# EAGLE design versao1 (EAGLE 9.6.2)
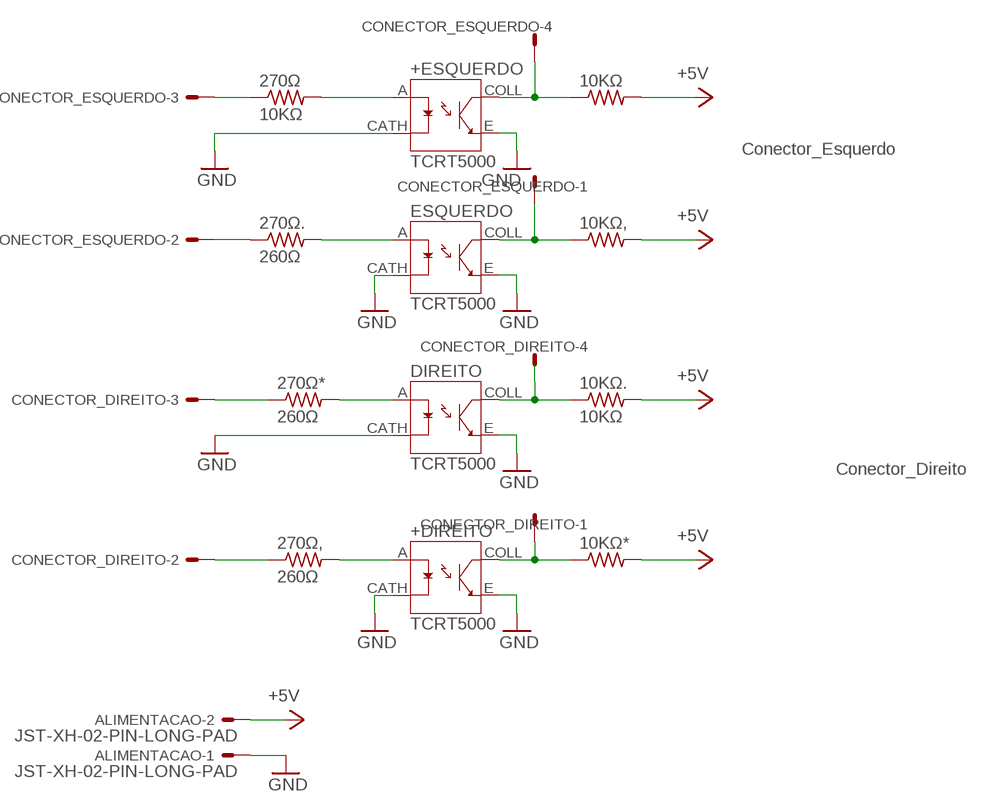
[diagram p0: schematic, sheet 1]

## Parts
10KΩ  R-US_0204/7  [0204/7]
10KΩ*  R-US_0204/7  [0204/7]
10KΩ,  R-US_0204/7  [0204/7]
10KΩ.  10KΩ  R-US_0204/7  [0204/7]
270Ω  10KΩ  R-US_0204/7  [0204/7]
270Ω*  260Ω  R-US_0204/7  [0204/7]
270Ω,  260Ω  R-US_0204/7  [0204/7]
270Ω.  260Ω  R-US_0204/7  [0204/7]
+DIREITO  TCRT5000  [OPTO_TCRT5000]
+ESQUERDO  TCRT5000  [OPTO_TCRT5000]
ALIMENTACAO  JST-XH-02-PIN-LONG-PAD  [JST-XH-02-PACKAGE-LONG-PAD]
CONECTOR_DIREITO  Conector_Direito  JST-XH-04-PIN-LONG-PAD  [JST-XH-04-PACKAGE-LONG-PAD]
CONECTOR_ESQUERDO  Conector_Esquerdo  JST-XH-04-PIN-LONG-PAD  [JST-XH-04-PACKAGE-LONG-PAD]
DIREITO  TCRT5000  [OPTO_TCRT5000]
ESQUERDO  TCRT5000  [OPTO_TCRT5000]

## Nets
+5V: 10KΩ*.2 10KΩ,.2 10KΩ.2 10KΩ..2 ALIMENTACAO.2
ANALOG_+DI: 10KΩ*.1 +DIREITO.COLL CONECTOR_DIREITO.1
ANALOG_+ESQ.: 10KΩ.1 +ESQUERDO.COLL CONECTOR_ESQUERDO.4
ANALOG_DI: 10KΩ..1 CONECTOR_DIREITO.4 DIREITO.COLL
ANALOG_ESQ: 10KΩ,.1 CONECTOR_ESQUERDO.1 ESQUERDO.COLL
DIGITAL+ESQ.: 270Ω.1 CONECTOR_ESQUERDO.3
DIGITAL_+DI: 270Ω,.1 CONECTOR_DIREITO.2
DIGITAL_DI: 270Ω*.1 CONECTOR_DIREITO.3
DIGITAL_ESQ.: 270Ω..1 CONECTOR_ESQUERDO.2
GND: +DIREITO.CATH +DIREITO.E +ESQUERDO.CATH +ESQUERDO.E ALIMENTACAO.1 DIREITO.CATH DIREITO.E ESQUERDO.CATH ESQUERDO.E
N$1: 270Ω.2 +ESQUERDO.A
N$2: 270Ω..2 ESQUERDO.A
N$3: 270Ω*.2 DIREITO.A
N$4: 270Ω,.2 +DIREITO.A

## Library data of the parts
10KΩ 10KΩ* 10KΩ, 10KΩ. 270Ω 270Ω* 270Ω, 270Ω. = rcl_robotica:R-US_: RESISTOR, American symbol; SPICEPREFIX: R
+DIREITO +ESQUERDO DIREITO ESQUERDO = TCRT5000:TCRT5000: 950 nm 60 mA Through Hole Reflective Optical Sensor with Transistor Output Check availability <https://pricing.snapeda.com/parts/TCRT5000/Vishay/view-part?ref=eda>; AVAILABILITY: In Stock; DESCRIPTION: Reflective Optical Sensor 0.591 (15mm) PCB Mount; MF: Vishay; MP: TCRT5000; PACKAGE: TCRT5000 Vishay; PRICE: None; PURCHASE-URL: https://pricing.snapeda.com/search?q=TCRT5000&ref=eda
ALIMENTACAO = Rembrandt Electronics - JST XH Connectors v1-0:JST-XH-02-PIN: JST XH Connector 2 Pin Wire to board connector. Pitch: 2,54 mm, (0.100") Number of pins: 2 Created by Rembrandt Electronics www.rembrandtelectronics.com
CONECTOR_DIREITO CONECTOR_ESQUERDO = Rembrandt Electronics - JST XH Connectors v1-0:JST-XH-04-PIN: JST XH Connector 2 Pin Wire to board connector. Pitch: 2,54 mm, (0.100") Number of pins: 4 Created by Rembrandt Electronics www.rembrandtelectronics.com

## Board
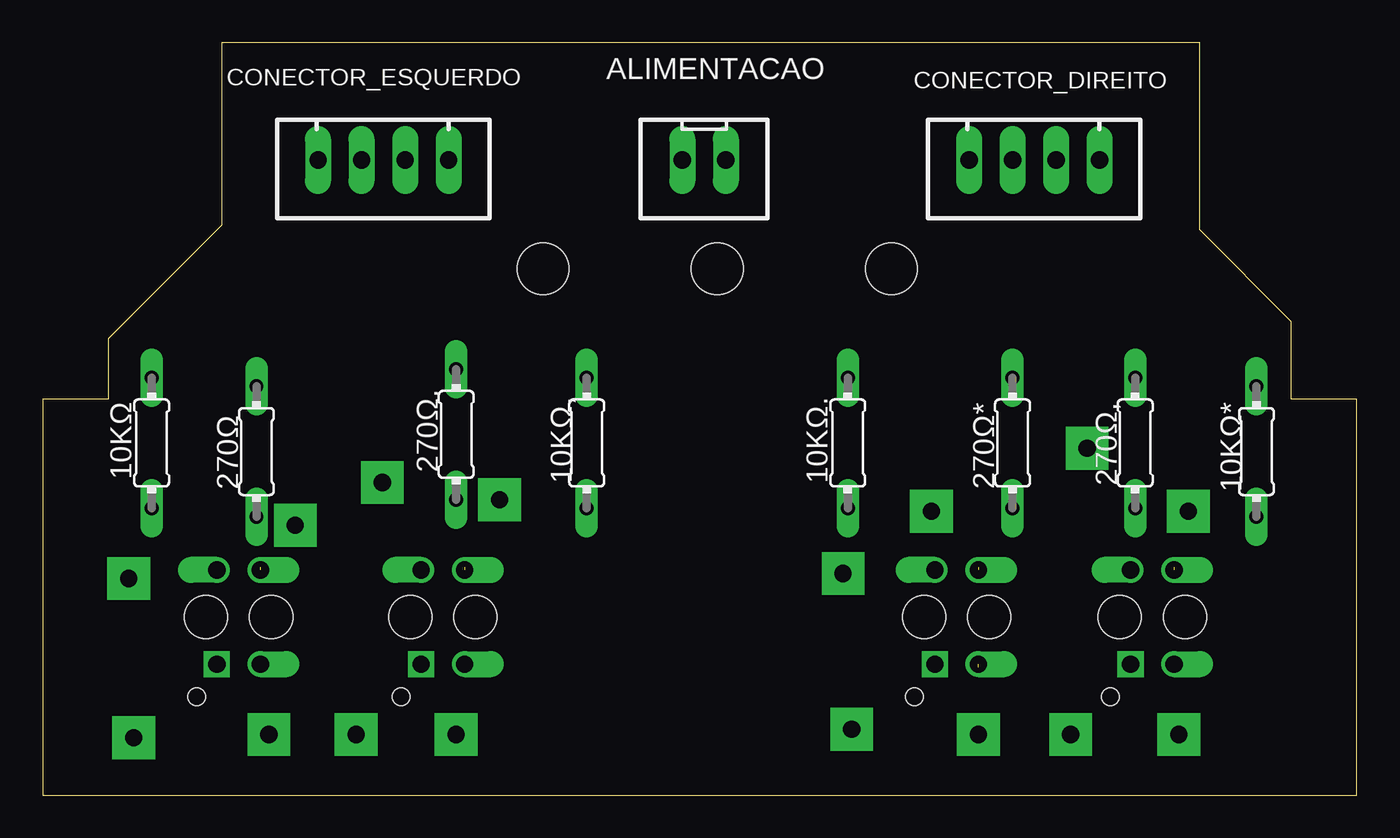
[diagram p1: board, top side]
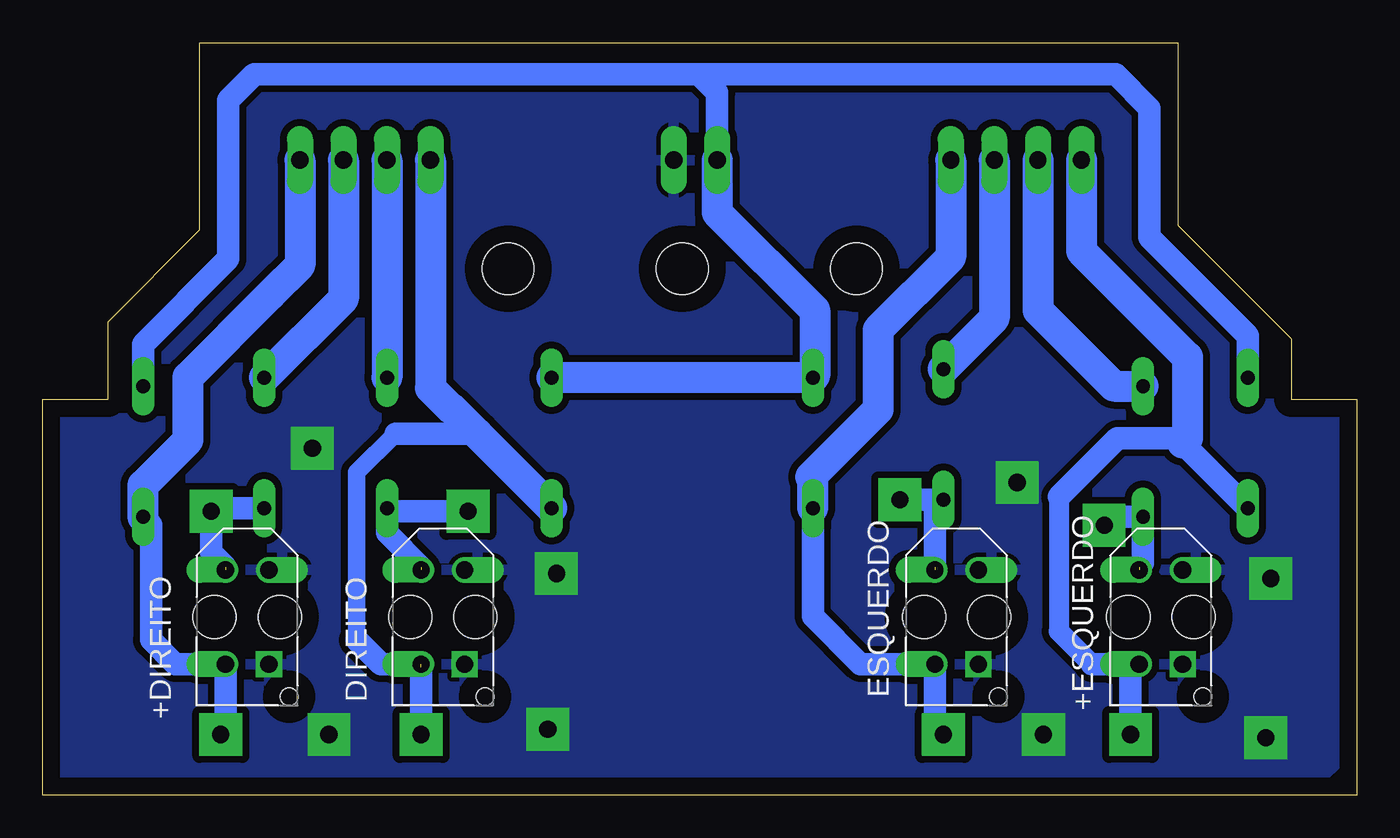
[diagram p2: board, bottom side, seen from below]

Size 76.7 x 43.9 mm. Coordinates in mm from the lower left corner, seen from the top.
Outline: 0,0 76.7,0 76.7,23.09 72.89,23.09 72.89,27.63 67.54,32.98 67.53,43.9 10.43,43.9 10.43,33.25 3.81,26.63 3.81,23.09 0,23.09 0,0
Copper layers (1*16): Top 0.035mm / dielectric 1.5mm / Bottom 0.035mm
Design rules "default *": minimum track width 6mil, minimum drill 0.35mm, track to track 16mil, track to pad 16mil, pad to pad 16mil, via to via 16mil, smd to smd 6mil, copper to edge 40mil, drill to drill 6mil, minimum pad ring 10mil, minimum via ring 8mil, stop-mask expansion 4mil, vias tented up to drill 0mil, thermal gap 10mil
Holes 3 mm at 29.21,30.71 49.53,30.71 39.37,30.71

### Footprints (pad centres in the part's own frame; a part is rotated, then mirrored left to right if it is on the bottom)
0204/7 = drill 0.813 long: 1 -3.81,0; 2 3.81,0
OPTO_TCRT5000 = drill 1 pad 1.524 offset: A 2.75,1.27; CATH 2.75,-1.27; COLL -2.75,1.27 | drill 1 pad 1.524 square: E -2.75,-1.27 | hole 1: -4.65,-2.45 | hole 2.5: 0,-1.9; 0,1.9
JST-XH-02-PACKAGE-LONG-PAD = drill 1.016 long: 1 -1.27,0; 2 1.27,0
JST-XH-04-PACKAGE-LONG-PAD = drill 1.016 long: 1 -3.81,0; 2 -1.27,0; 3 1.27,0; 4 3.81,0

### Placement (x,y rotation side)
10KΩ  6.35,20.55 90 top
10KΩ*  70.85,20.05 90 top
10KΩ,  31.75,20.55 90 top
10KΩ.  46.99,20.55 90 top
270Ω  12.47,20.05 270 top
270Ω*  56.61,20.55 270 top
270Ω,  63.77,20.55 270 top
270Ω.  24.13,21.05 270 top
+DIREITO  64.77,10.39 90 bottom
+ESQUERDO  11.43,10.39 90 bottom
ALIMENTACAO  38.6,37.06 180 top
CONECTOR_DIREITO  57.88,37.06 180 top
CONECTOR_ESQUERDO  19.88,37.06 180 top
DIREITO  53.34,10.39 90 bottom
ESQUERDO  23.36,10.39 90 bottom

### Tracks (layer width: path | path; a pad name or v marks a point on that pad's centre or on a via)
+5V
  Bottom 1.27: 37.38,37.11 ALIMENTACAO.2
  Bottom 1.3: 38.38,42.06 14.07,42.06 12.1,40.09 12.1,32.56 6.35,26.81 10KΩ.2 | 38.38,42.06 64.37,42.06 65.87,40.56 65.87,31.29 70.85,26.31 10KΩ*.2 | ALIMENTACAO.2 37.33,41.01 38.38,42.06
  Bottom 1.8: ALIMENTACAO.2 37.33,34 31.64,28.3 31.64,24.47 10KΩ,.2 10KΩ..2
ANALOG_+DI  (via drill 1 pad 2.5)
  Bottom 1.3: v66.31,3.54 66.04,3.81 +DIREITO.COLL 68.96,7.64 70.38,9.06 70.38,15.77 10KΩ*.1
  Bottom 1.8: CONECTOR_DIREITO.1 61.69,30.92 63.42,29.19 68.22,24.4 68.22,20.72 70.85,18.09 10KΩ*.1
ANALOG_+ESQ.  (via drill 1 pad 2.5)
  Bottom 0.813: 10.16,20.55 10.16,20.78 10.38,20.56
  Bottom 1.18: 17.38,17.41 17.38,9.56
  Bottom 1.2: 17.38,9.56 15.46,7.64
  Bottom 1.3: 9.88,20.83 13.96,20.83 17.38,17.41 | 10KΩ.1 10.17,20.56 10.38,20.56 | v13.2,3.54 13.2,7.14 +ESQUERDO.COLL 15.46,7.64
  Bottom 1.8: CONECTOR_ESQUERDO.4 16.07,31.75 9.88,25.56 9.88,20.83 10.16,20.55
ANALOG_DI  (via drill 1 pad 2.5)  (1 unrouted)
  Bottom 1.016: 58.38,9.06 58.38,18.83 56.11,21.09
  Bottom 1.3: 51.35,21.09 56.11,21.09 | v54.61,3.54 54.61,7.47 | DIREITO.COLL 56.96,7.64 58.38,9.06
  Bottom 1.8: CONECTOR_DIREITO.4 54.07,23.75 52.88,22.56 52.81,22.56 51.35,21.09 10KΩ..1
ANALOG_ESQ  (via drill 1 pad 2.5)
  Bottom 0.813: 24.84,7.85 ESQUERDO.COLL
  Bottom 1.3: v24.13,3.54 24.63,4.04 ESQUERDO.COLL 28.96,7.64 31.75,10.43 10KΩ,.1
  Bottom 1.8: CONECTOR_ESQUERDO.1 23.69,31.4 27.94,27.15 27.94,22.5 31.88,18.56 31.75,18.43 10KΩ,.1
DIGITAL+ESQ.
  Bottom 1.8: CONECTOR_ESQUERDO.3 18.61,28.29 14.18,23.86 270Ω.1
DIGITAL_+DI
  Bottom 1.8: 270Ω,.1 59.15,28.98 CONECTOR_DIREITO.2
DIGITAL_DI
  Bottom 1.8: CONECTOR_DIREITO.3 270Ω*.1
DIGITAL_ESQ.
  Bottom 1.8: CONECTOR_ESQUERDO.2 21.15,27.84 270Ω..1
GND  (via drill 1 pad 2.5)
  other vias: 5.31,3.35 5.02,12.64 18.28,3.54 19.82,18.24 46.72,12.93 47.22,3.85 60,3.54 60.96,20.24
  pour Bottom: 0,3 3.08,-0.08 76.35,-0.08 79.7,3.27 79.7,29.75 64.77,44.68 12.7,44.68 0.19,32.17 0,21.82
N$1  (via drill 1 pad 2.5)  (1 unrouted)
  Bottom 1.3: v14.74,15.74 14.24,16.24 270Ω.2 12.47,13.54 12.7,13.31
N$2  (via drill 1 pad 2.5)  (1 unrouted)
  Bottom 1.3: v26.67,17.24 270Ω..2 24.63,16.74 24.63,13.31
N$3  (via drill 1 pad 2.5)  (1 unrouted)
  Bottom 1.3: 54.61,13.31 56.61,15.31 270Ω*.2 56.43,16.56 v51.88,16.56
N$4  (via drill 1 pad 2.5)  (1 unrouted)
  Bottom 1.3: 270Ω,.2 66.7,16.74 v66.88,16.56 66.88,14.15 66.04,13.31